# Altium schematic sheet Enconder_Part2.SchDoc
size A4
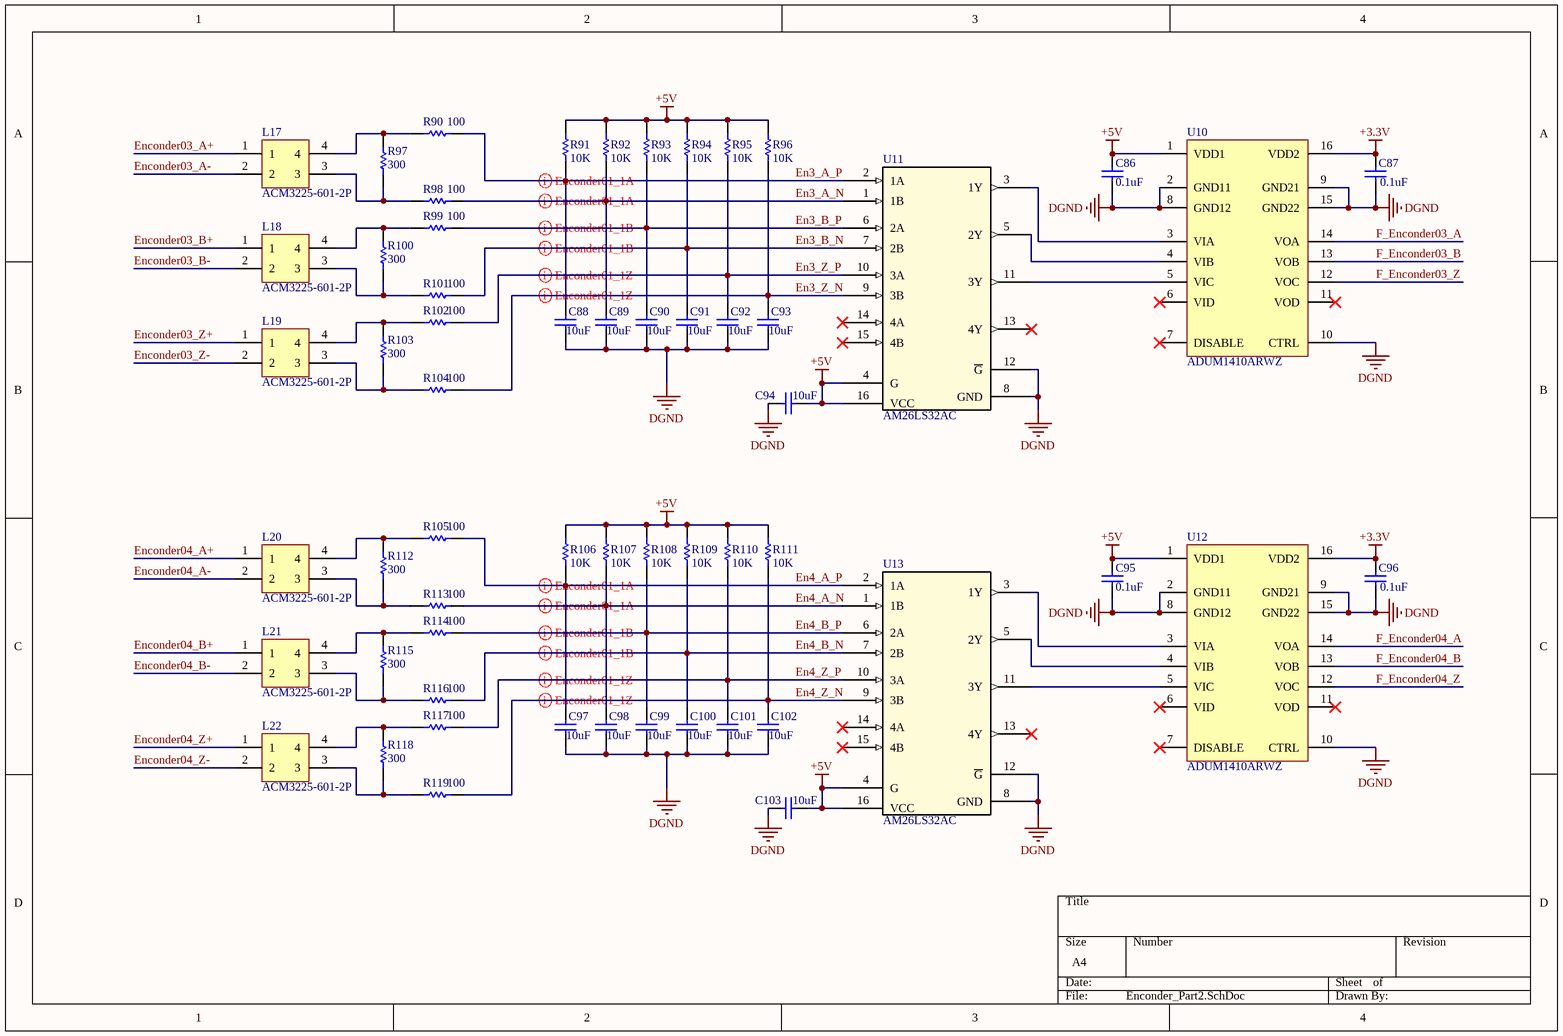
[diagram p0: Enconder_Part2.SchDoc]

## Parts
C86  value 0.1uF  [1608[0603]]  (hidden comment: Cap)
C87  value 0.1uF  [1608[0603]]  (hidden comment: Cap)
C88  value 10uF  [1608[0603]]  (hidden comment: Cap)
C89  value 10uF  [1608[0603]]  (hidden comment: Cap)
C90  value 10uF  [1608[0603]]  (hidden comment: Cap)
C91  value 10uF  [1608[0603]]  (hidden comment: Cap)
C92  value 10uF  [1608[0603]]  (hidden comment: Cap)
C93  value 10uF  [1608[0603]]  (hidden comment: Cap)
C94  value 10uF  [1608[0603]]  (hidden comment: Cap)
C95  value 0.1uF  [1608[0603]]  (hidden comment: Cap)
C96  value 0.1uF  [1608[0603]]  (hidden comment: Cap)
C97  value 10uF  [1608[0603]]  (hidden comment: Cap)
C98  value 10uF  [1608[0603]]  (hidden comment: Cap)
C99  value 10uF  [1608[0603]]  (hidden comment: Cap)
C100  value 10uF  [1608[0603]]  (hidden comment: Cap)
C101  value 10uF  [1608[0603]]  (hidden comment: Cap)
C102  value 10uF  [1608[0603]]  (hidden comment: Cap)
C103  value 10uF  [1608[0603]]  (hidden comment: Cap)
L17  ACM3225-601-2P  [ACM3225-601-2P]
L18  ACM3225-601-2P  [ACM3225-601-2P]
L19  ACM3225-601-2P  [ACM3225-601-2P]
L20  ACM3225-601-2P  [ACM3225-601-2P]
L21  ACM3225-601-2P  [ACM3225-601-2P]
L22  ACM3225-601-2P  [ACM3225-601-2P]
R90  value 100  [1608[0603]]  (hidden comment: Res1)
R91  value 10K  [1608[0603]]  (hidden comment: Res1)
R92  value 10K  [1608[0603]]  (hidden comment: Res1)
R93  value 10K  [1608[0603]]  (hidden comment: Res1)
R94  value 10K  [1608[0603]]  (hidden comment: Res1)
R95  value 10K  [1608[0603]]  (hidden comment: Res1)
R96  value 10K  [1608[0603]]  (hidden comment: Res1)
R97  value 300  [1608[0603]]  (hidden comment: Res1)
R98  value 100  [1608[0603]]  (hidden comment: Res1)
R99  value 100  [1608[0603]]  (hidden comment: Res1)
R100  value 300  [1608[0603]]  (hidden comment: Res1)
R101  value 100  [1608[0603]]  (hidden comment: Res1)
R102  value 100  [1608[0603]]  (hidden comment: Res1)
R103  value 300  [1608[0603]]  (hidden comment: Res1)
R104  value 100  [1608[0603]]  (hidden comment: Res1)
R105  value 100  [1608[0603]]  (hidden comment: Res1)
R106  value 10K  [1608[0603]]  (hidden comment: Res1)
R107  value 10K  [1608[0603]]  (hidden comment: Res1)
R108  value 10K  [1608[0603]]  (hidden comment: Res1)
R109  value 10K  [1608[0603]]  (hidden comment: Res1)
R110  value 10K  [1608[0603]]  (hidden comment: Res1)
R111  value 10K  [1608[0603]]  (hidden comment: Res1)
R112  value 300  [1608[0603]]  (hidden comment: Res1)
R113  value 100  [1608[0603]]  (hidden comment: Res1)
R114  value 100  [1608[0603]]  (hidden comment: Res1)
R115  value 300  [1608[0603]]  (hidden comment: Res1)
R116  value 100  [1608[0603]]  (hidden comment: Res1)
R117  value 100  [1608[0603]]  (hidden comment: Res1)
R118  value 300  [1608[0603]]  (hidden comment: Res1)
R119  value 100  [1608[0603]]  (hidden comment: Res1)
U10  ADUM1410ARWZ  [ADUM1410ARWZ_SOIC]
U11  AM26LS32AC  [AM26LS32AC_SOP]
U12  ADUM1410ARWZ  [ADUM1410ARWZ_SOIC]
U13  AM26LS32AC  [AM26LS32AC_SOP]

## Nets
+3.3V: C87.2 C96.2 U10.16(VDD2) U12.16(VDD2)
+5V: C86.2 C94.1 C95.2 C103.1 R91.2 R92.2 R93.2 R94.2 R95.2 R96.2 R106.2 R107.2 R108.2 R109.2 R110.2 R111.2 U10.1(VDD1) U11.4(G) U11.16(VCC) U12.1(VDD1) U13.4(G) U13.16(VCC)
DGND: C86.1 C87.1 C88.1 C89.1 C90.1 C91.1 C92.1 C93.1 C94.2 C95.1 C96.1 C97.1 C98.1 C99.1 C100.1 C101.1 C102.1 C103.2 U10.2(GND11) U10.8(GND12) U10.9(GND21) U10.10(CTRL) U10.15(GND22) U11.8(GND) U11.12(~{G}) U12.2(GND11) U12.8(GND12) U12.9(GND21) U12.10(CTRL) U12.15(GND22) U13.8(GND) U13.12(~{G})
En3_A_N: C89.2 R92.1 R98.2 U11.1(1B)
En3_A_P: C88.2 R90.2 R91.1 U11.2(1A)
En3_B_N: C91.2 R94.1 R101.2 U11.7(2B)
En3_B_P: C90.2 R93.1 R99.2 U11.6(2A)
En3_Z_N: C93.2 R96.1 R104.2 U11.9(3B)
En3_Z_P: C92.2 R95.1 R102.2 U11.10(3A)
En4_A_N: C98.2 R107.1 R113.2 U13.1(1B)
En4_A_P: C97.2 R105.2 R106.1 U13.2(1A)
En4_B_N: C100.2 R109.1 R116.2 U13.7(2B)
En4_B_P: C99.2 R108.1 R114.2 U13.6(2A)
En4_Z_N: C102.2 R111.1 R119.2 U13.9(3B)
En4_Z_P: C101.2 R110.1 R117.2 U13.10(3A)
Enconder03_A+: L17.1
Enconder03_A-: L17.2
Enconder03_B+: L18.1
Enconder03_B-: L18.2
Enconder03_Z+: L19.1
Enconder03_Z-: L19.2
Enconder04_A+: L20.1
Enconder04_A-: L20.2
Enconder04_B+: L21.1
Enconder04_B-: L21.2
Enconder04_Z+: L22.1
Enconder04_Z-: L22.2
F_Enconder03_A: U10.14(VOA)
F_Enconder03_B: U10.13(VOB)
F_Enconder03_Z: U10.12(VOC)
F_Enconder04_A: U12.14(VOA)
F_Enconder04_B: U12.13(VOB)
F_Enconder04_Z: U12.12(VOC)
NetL17_3: L17.3 R97.1 R98.1
NetL17_4: L17.4 R90.1 R97.2
NetL18_3: L18.3 R100.1 R101.1
NetL18_4: L18.4 R99.1 R100.2
NetL19_3: L19.3 R103.1 R104.1
NetL19_4: L19.4 R102.1 R103.2
NetL20_3: L20.3 R112.1 R113.1
NetL20_4: L20.4 R105.1 R112.2
NetL21_3: L21.3 R115.1 R116.1
NetL21_4: L21.4 R114.1 R115.2
NetL22_3: L22.3 R118.1 R119.1
NetL22_4: L22.4 R117.1 R118.2
NetU10_3: U10.3(VIA) U11.3(1Y)
NetU10_4: U10.4(VIB) U11.5(2Y)
NetU10_5: U10.5(VIC) U11.11(3Y)
NetU12_3: U12.3(VIA) U13.3(1Y)
NetU12_4: U12.4(VIB) U13.5(2Y)
NetU12_5: U12.5(VIC) U13.11(3Y)

Not connected (* = marked no-connect by the designer): U10 6(VID)* 7(DISABLE)* 11(VOD)*; U11 13(4Y)* 14(4A)* 15(4B)*; U12 6(VID)* 7(DISABLE)* 11(VOD)*; U13 13(4Y)* 14(4A)* 15(4B)*

## Layout directives
differential pair: En3_A_N, En3_A_P, En3_B_N, En3_B_P, En3_Z_N, En3_Z_P, En4_A_N, En4_A_P, En4_B_N, En4_B_P, En4_Z_N, En4_Z_P

## Library data of the parts
C86-C103 = Cap: Capacitor; Published: 8-Jun-2000; LatestRevisionDate: 17-Jul-2002; LatestRevisionNote: Re-released for DXP Platform.; PackageReference: RAD-0.3; Publisher: Altium Limited; PackageDescription: Radial Cap, Thru-Hole; 2 Leads; 0.3 in Pin Spacing
R90-R119 = Res1: Resistor; Published: 8-Jun-2000; LatestRevisionDate: 17-Jul-2002; LatestRevisionNote: Re-released for DXP Platform.; PackageReference: AXIAL-0.3; Publisher: Altium Limited; PackageDescription: Axial Device, Thru-Hole; 2 Leads; 0.3 in Pin Spacing